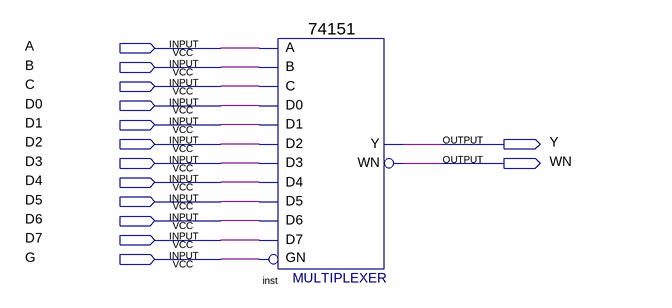
[diagram p0: schematic sheet]
// Quartus schematic Question2.bdf as structural Verilog: 1 symbols, 14 pins
module Question2 (
  input  A,
  input  B,
  input  C,
  input  D0,
  input  D1,
  input  D2,
  input  D3,
  input  D4,
  input  D5,
  input  D6,
  input  D7,
  input  G,
  output Y,
  output WN
);

  \74151  inst (
    .GN(G), .C(C), .B(B), .A(A), .D5(D5), .D0(D0), .D1(D1), .D4(D4), .D3(D3), .D2(D2), .D6(D6), .D7(D7),
    .Y(Y), .WN(WN));
endmodule
